# EAGLE design gatorrelays (EAGLE 7.2.0)
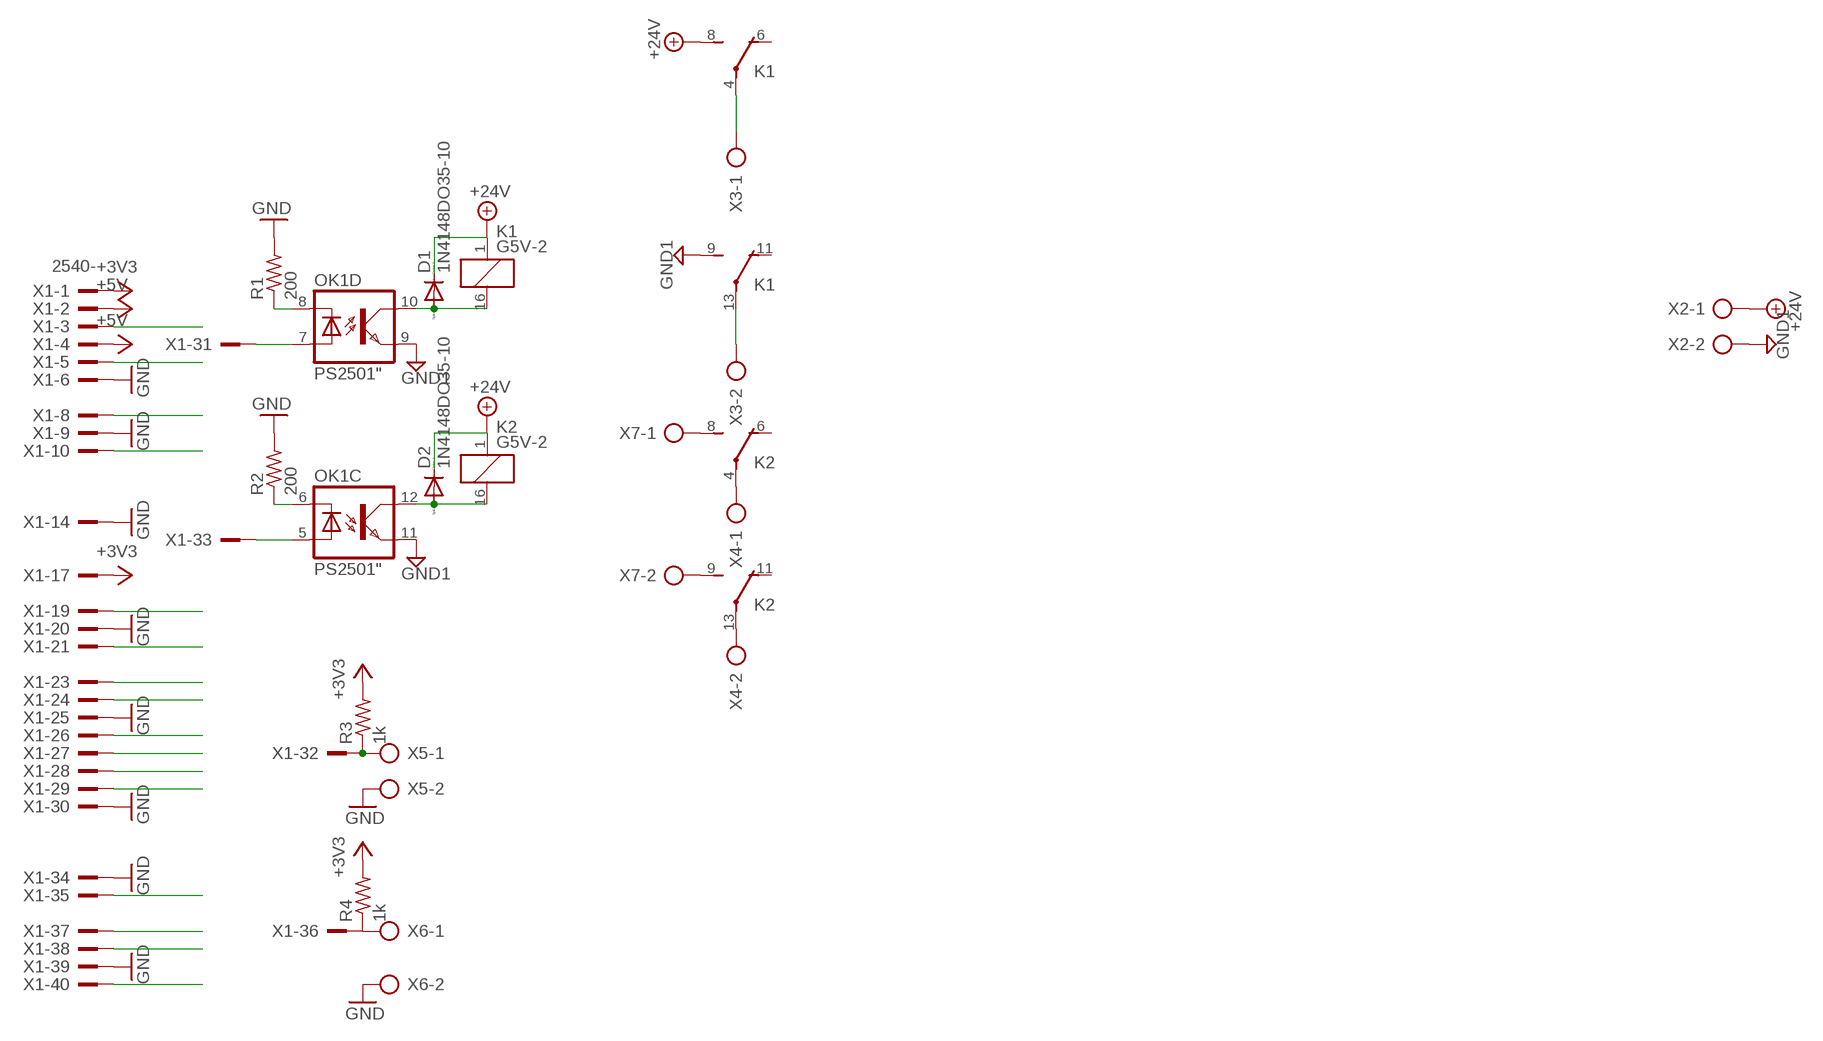
[diagram p0: schematic, sheet 1]

## Parts
D1  1N4148DO35-10  [DO35-10]
D2  1N4148DO35-10  [DO35-10]
K1  G5V-2  [G5V-2]
K2  G5V-2  [G5V-2]
OK1  PS2501"  [DIL16]
R1  200  R-US_0207/12  [0207/12]
R2  200  R-US_0207/12  [0207/12]
R3  1k  R-US_0207/12  [0207/12]
R4  1k  R-US_0207/12  [0207/12]
X1  2540-  [PAK100/2500-40]
X2  AK300/2  [AK300/2]
X3  AK300/2  [AK300/2]
X4  AK300/2  [AK300/2]
X5  AK300/2  [AK300/2]
X6  AK300/2  [AK300/2]
X7  AK300/2  [AK300/2]

## Nets
+3V3: R3.2 R4.2 X1.1 X1.17
+5V: X1.2 X1.4
+24V: D1.C D2.C K1.1 K1.8(1:S) K2.1 X2.1
GND: R1.2 R2.2 X1.6 X1.9 X1.14 X1.20 X1.25 X1.30 X1.34 X1.39 X5.2 X6.2
GND1: K1.9(2:S) OK1.9(D:EMI) OK1.11(C:EMI) X2.2
GPIO5: X1.29
GPIO6: OK1.7(D:A) X1.31
GPIO13: OK1.5(C:A) X1.33
GPIO19: X1.35
GPIO20: X1.38
GPIO21: X1.40
GPIO26: X1.37
N$1: OK1.8(D:C) R1.1
N$2: OK1.6(C:C) R2.1
N$3: R3.1 X1.32 X5.1
N$4: X1.36 X6.1
N$5: D1.A K1.16 OK1.10(D:COL)
N$6: D2.A K2.16 OK1.12(C:COL)
N$7: K1.4(1:P) X3.1
N$8: K1.13(2:P) X3.2
N$9: X1.3
N$10: X1.5
N$11: X1.8
N$12: X1.10
N$13: X1.19
N$14: X1.21
N$15: X1.23
N$16: X1.24
N$17: X1.26
N$18: X1.27
N$19: X1.28
N$20: R4.1 X6.1
N$21: K2.13(2:P) X4.2
N$22: K2.4(1:P) X4.1
N$23: K2.8(1:S) X7.1
N$24: K2.9(2:S) X7.2
Unconnected: K1.6(1:O) K1.11(2:O) K2.6(1:O) K2.11(2:O) OK1.1(A:A) OK1.2(A:C) OK1.3(B:A) OK1.4(B:C) OK1.13(B:EMI) OK1.14(B:COL) OK1.15(A:EMI) OK1.16(A:COL) X1.7 X1.11 X1.12 X1.13 X1.15 X1.16 X1.18 X1.22

## Library data of the parts
D1 D2 = diode:1N4148: DIODE high speed (Philips)
K1 K2 = relay:G5V-2: OMRON PCB Relay Source: http://www.omron.com/ecb/products/pdf/en-g5v2.pdf; MPN: G5V-2 5DC; OC_FARNELL: 9949488; OC_NEWARK: 78K5703
OK1 = optocoupler:PS2501: SHARP OPTO COUPLER
R1-R4 = resistor:R-US_: RESISTOR, American symbol
X1 = con-3m:2540-: 3M (TM) Pak 100 4-Wall Header Source: 3M; OC_FARNELL: unknown; OC_NEWARK: unknown
X2-X7 = con-ptr500:AK300/2: CONNECTOR; OC_FARNELL: unknown; OC_NEWARK: unknown

## Board
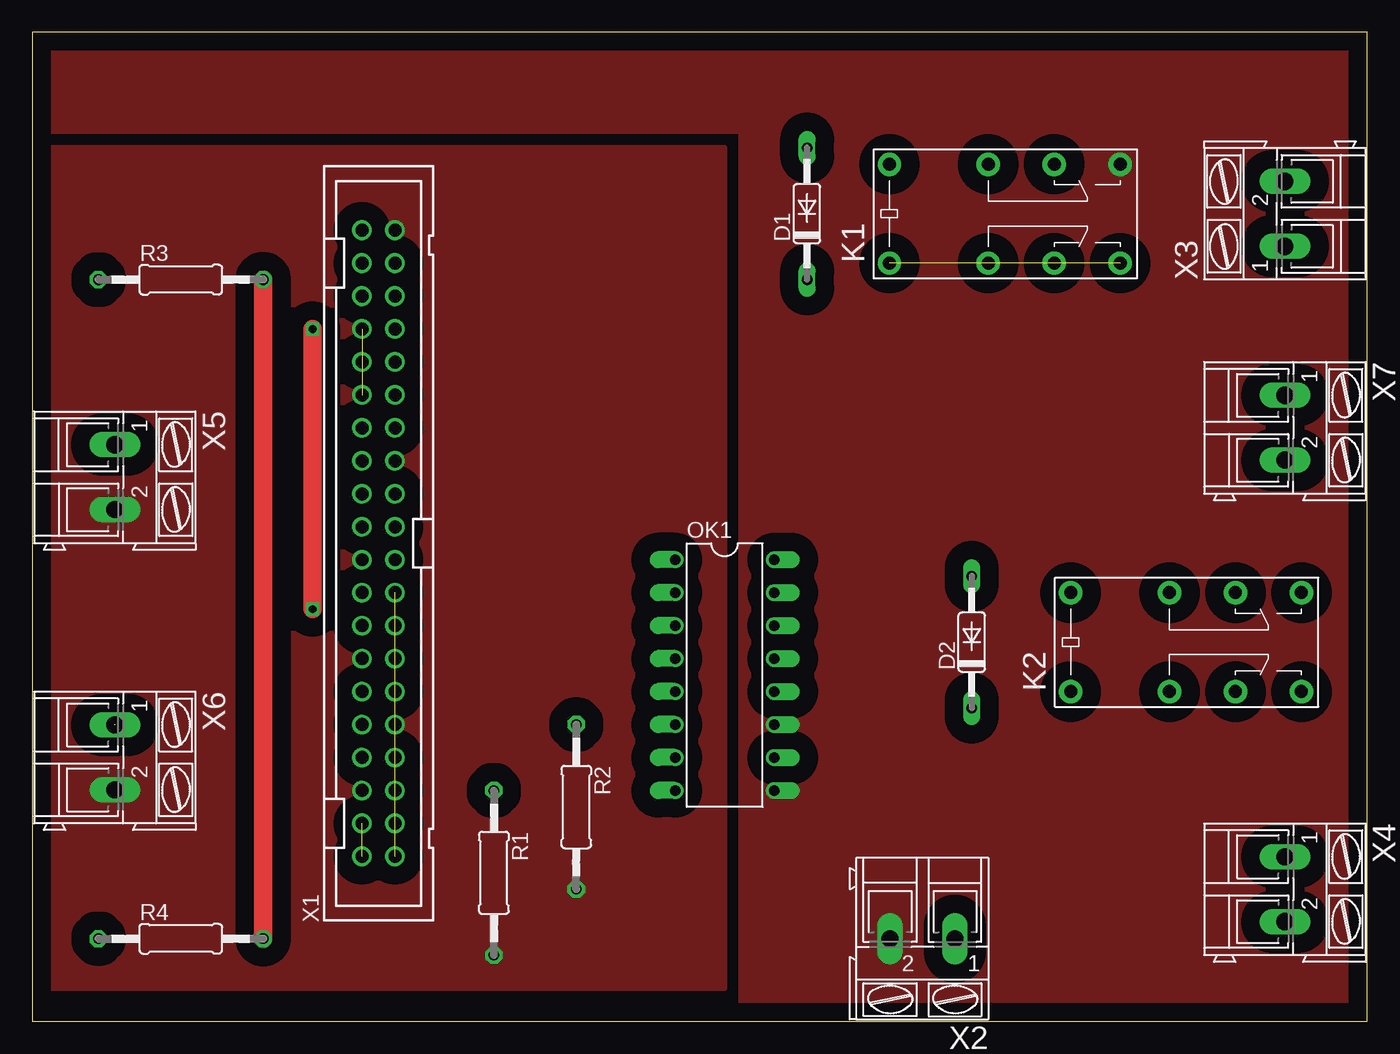
[diagram p1: board, top side]
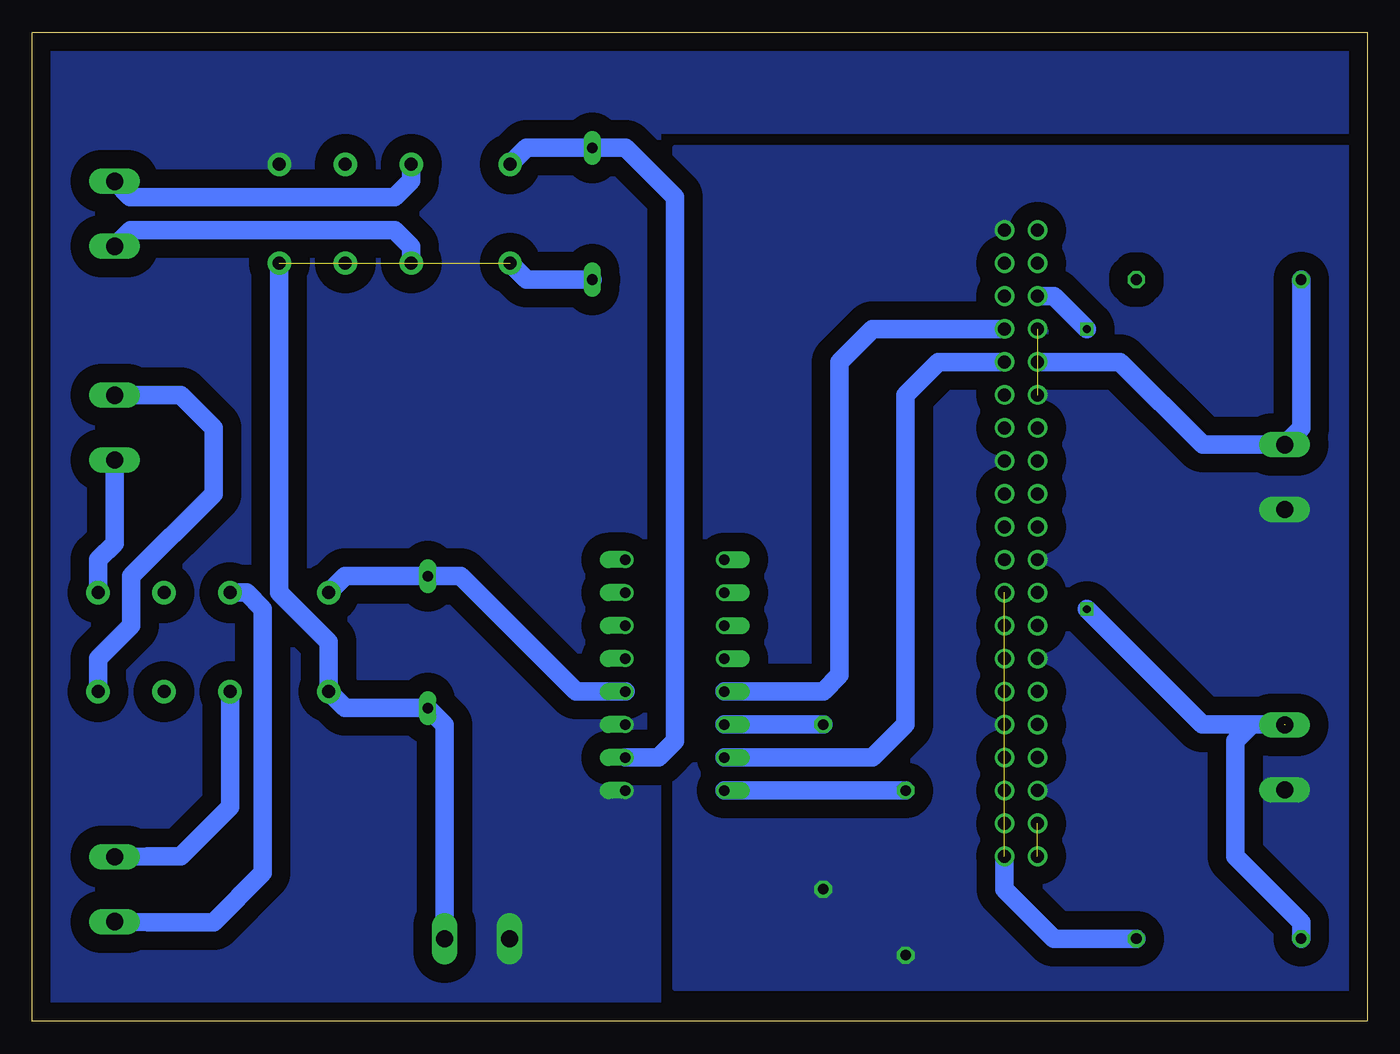
[diagram p2: board, bottom side, seen from below]

Size 102.85 x 76.2 mm. Coordinates in mm from the lower left corner, seen from the top.
Outline: 0,0 102.85,0 102.85,76.2 0,76.2 0,0
Copper layers (1*16): Top 0.035mm / dielectric 1.5mm / Bottom 0.035mm
Design rules "default": minimum track width 10mil, minimum drill 24mil, track to track 8mil, track to pad 8mil, pad to pad 8mil, via to via 8mil, smd to smd 8mil, copper to edge 40mil, drill to drill 8mil, minimum pad ring 10mil, minimum via ring 8mil, stop-mask expansion 4mil, vias tented up to drill 0mil, thermal gap 10mil

### Footprints (pad centres in the part's own frame; a part is rotated, then mirrored left to right if it is on the bottom)
DO35-10 = drill 0.813 long: A 5.08,0; C -5.08,0
G5V-2 = drill 1 pad 1.8: 1 -8.89,-3.81; 4 -1.27,-3.81; 6 3.81,-3.81; 8 8.89,-3.81; 9 8.89,3.81; 11 3.81,3.81; 13 -1.27,3.81; 16 -8.89,3.81
DIL16 = drill 0.813 offset: 1 -8.89,-3.81; 2 -6.35,-3.81; 3 -3.81,-3.81; 4 -1.27,-3.81; 5 1.27,-3.81; 6 3.81,-3.81; 7 6.35,-3.81; 8 8.89,-3.81; 9 8.89,3.81; 10 6.35,3.81; 11 3.81,3.81; 12 1.27,3.81; 13 -1.27,3.81; 14 -3.81,3.81; 15 -6.35,3.81; 16 -8.89,3.81
0207/12 = drill 0.813 octagon: 1 -6.35,0; 2 6.35,0
PAK100/2500-40 = drill 1 pad 1.422: 1 -24.13,-1.27; 2 -24.13,1.27; 3 -21.59,-1.27; 4 -21.59,1.27; 5 -19.05,-1.27; 6 -19.05,1.27; 7 -16.51,-1.27; 8 -16.51,1.27; 9 -13.97,-1.27; 10 -13.97,1.27; 11 -11.43,-1.27; 12 -11.43,1.27; 13 -8.89,-1.27; 14 -8.89,1.27; 15 -6.35,-1.27; 16 -6.35,1.27; 17 -3.81,-1.27; 18 -3.81,1.27; 19 -1.27,-1.27; 20 -1.27,1.27; 21 1.27,-1.27; 22 1.27,1.27; 23 3.81,-1.27; 24 3.81,1.27; 25 6.35,-1.27; 26 6.35,1.27; 27 8.89,-1.27; 28 8.89,1.27; 29 11.43,-1.27; 30 11.43,1.27; 31 13.97,-1.27; 32 13.97,1.27; 33 16.51,-1.27; 34 16.51,1.27; 35 19.05,-1.27; 36 19.05,1.27; 37 21.59,-1.27; 38 21.59,1.27; 39 24.13,-1.27; 40 24.13,1.27
AK300/2 = drill 1.321 long: 1 -2.515,0; 2 2.489,0

### Placement (x,y rotation side)
D1  59.69,62.23 90 top
D2  72.39,29.21 90 top
K1  74.93,62.23 0 top
K2  88.9,29.21 0 top
OK1  53.34,26.67 270 top
R1  35.56,11.43 270 top
R2  41.91,16.51 270 top
R3  11.43,57.15 0 top
R4  11.43,6.35 0 top
X1  26.67,36.83 90 top
X2  68.58,6.35 180 top
X3  96.52,62.23 90 top
X4  96.52,10.16 270 top
X5  6.35,41.91 270 top
X6  6.35,20.32 270 top
X7  96.52,45.72 270 top

### Tracks (layer width: path | path; a pad name or v marks a point on that pad's centre or on a via)
+3V3  (1 unrouted)
  Top 1.422: R3.2 R4.2
  Bottom 1.422: R4.2 24.13,6.35 27.94,10.16 X1.1
+5V  (1 unrouted)
+24V  (1 unrouted)
  Bottom 1.422: D1.C 64.77,57.15 K1.1 | X2.1 71.09,22.84 D2.C 78.74,24.13 K2.1 80.01,29.21 83.82,33.02 K1.8
GND  (1 unrouted)
  pour Bottom (isolate 1.422, no thermals): 0,67.31 53.34,67.31 53.34,2.54 0,2.54
  pour Top (isolate 1.422, no thermals): 0,67.31 53.34,67.31 53.34,2.54 0,2.54
GND1
  pour Bottom (isolate 1.422, no thermals): 0,76.2 102.87,76.2 102.87,0 54.61,0 54.61,68.58 0,68.58
  pour Top (isolate 1.422, no thermals): 0,76.2 102.87,76.2 102.87,0 54.61,0 54.61,68.58 0,68.58
GPIO6
  Bottom 1.422: X1.31 33.02,50.8 35.56,48.26 35.56,22.86 38.1,20.32 OK1.7
GPIO13
  Bottom 1.422: OK1.5 41.91,25.4 40.64,26.67 40.64,50.8 38.1,53.34 X1.33
N$1
  Bottom 1.422: R1.1 OK1.8
N$2
  Bottom 1.422: R2.1 OK1.6
N$3
  Bottom 1.422: R3.1 5.08,45.7 X5.1 12.68,44.42 19.05,50.8 X1.32
N$4  (via drill 0.6)  (1 unrouted)
  Top 1.422: v21.59,53.34 v21.59,31.75
  Bottom 1.422: X1.36 24.13,55.88 v21.59,53.34 | v21.59,31.75 12.7,22.86 6.35,22.86
N$5
  Bottom 1.422: K1.16 64.77,67.31 D1.A 57.15,67.31 53.34,63.5 53.34,21.59 54.61,20.32 OK1.10
N$6
  Bottom 1.422: K2.16 78.74,34.29 D2.A 69.85,34.29 60.96,25.4 OK1.12
N$7
  Bottom 1.422: K1.4 73.66,59.69 74.93,60.96 95.28,60.96 X3.1
N$8
  Bottom 1.422: K1.13 73.66,64.77 74.93,63.5 95.3,63.5 X3.2
N$20  (1 unrouted)
  Bottom 1.422: R4.1 5.08,7.62 10.16,12.7 10.16,21.59 8.89,22.86 6.35,22.86
N$21
  Bottom 1.422: K2.13 86.36,33.02 85.09,31.75 85.09,11.43 88.9,7.62 93.93,7.62 X4.2
N$22
  Bottom 1.422: K2.4 87.63,16.51 91.44,12.7 93.96,12.7 X4.1
N$23
  Bottom 1.422: K2.8 97.79,27.94 95.25,30.48 95.25,34.29 88.9,40.64 88.9,45.72 91.44,48.26 93.96,48.26 X7.1
N$24
  Bottom 1.422: K2.9 97.79,35.56 96.52,36.83 X7.2